# Altium schematic sheet Шаблон А1 В Лист_2.SchDoc: Название изделия
size 594 x 840 mm; ApprovedBy: Утвердил; CheckedBy: Проверил; Author: Разработал; CompanyName: Организация; Engineer: Нормоконтроль; DocumentNumber: Децимальный номер; SheetNumber: 1; SheetTotal: 1; Lit_1: У; Technologist: Технолог
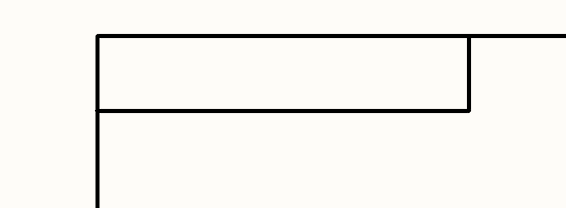
[diagram p0: Шаблон А1 В Лист_2.SchDoc, top left]
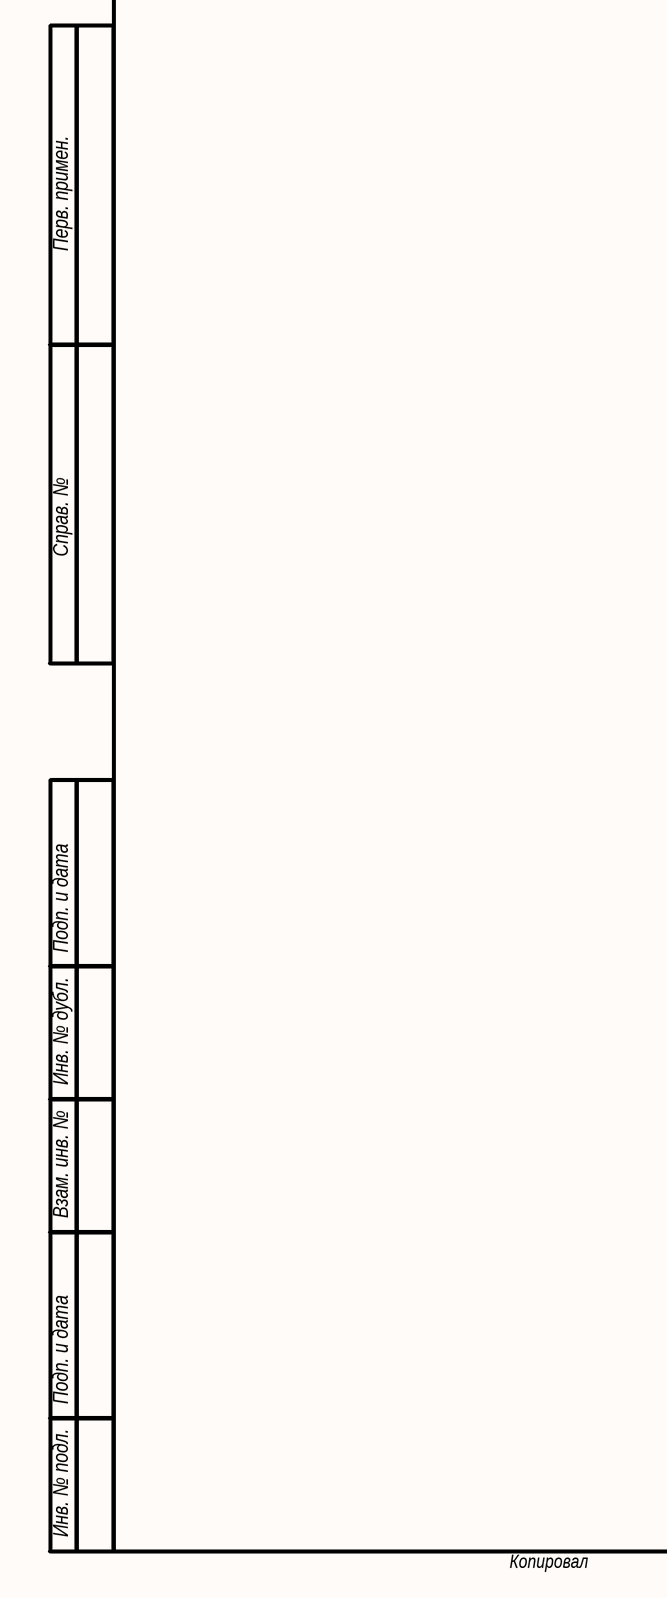
[diagram p1: Шаблон А1 В Лист_2.SchDoc, bottom left]
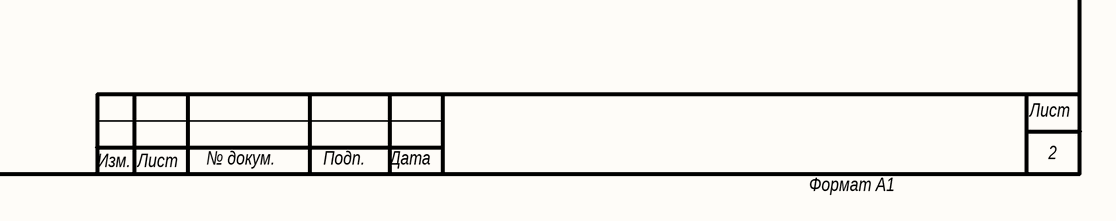
[diagram p2: Шаблон А1 В Лист_2.SchDoc, bottom right]

## Notes on the sheet
- Перв. примен.
- Справ. №
- Подп. и дата
- Инв. № дубл.
- Взам. инв. №
- Инв. № подл.
- Изм.
- Лист
- № докум.
- Подп.
- Дата
- 2
- Копировал
- Формат А1